# EAGLE design main board (EAGLE 6.5.0)
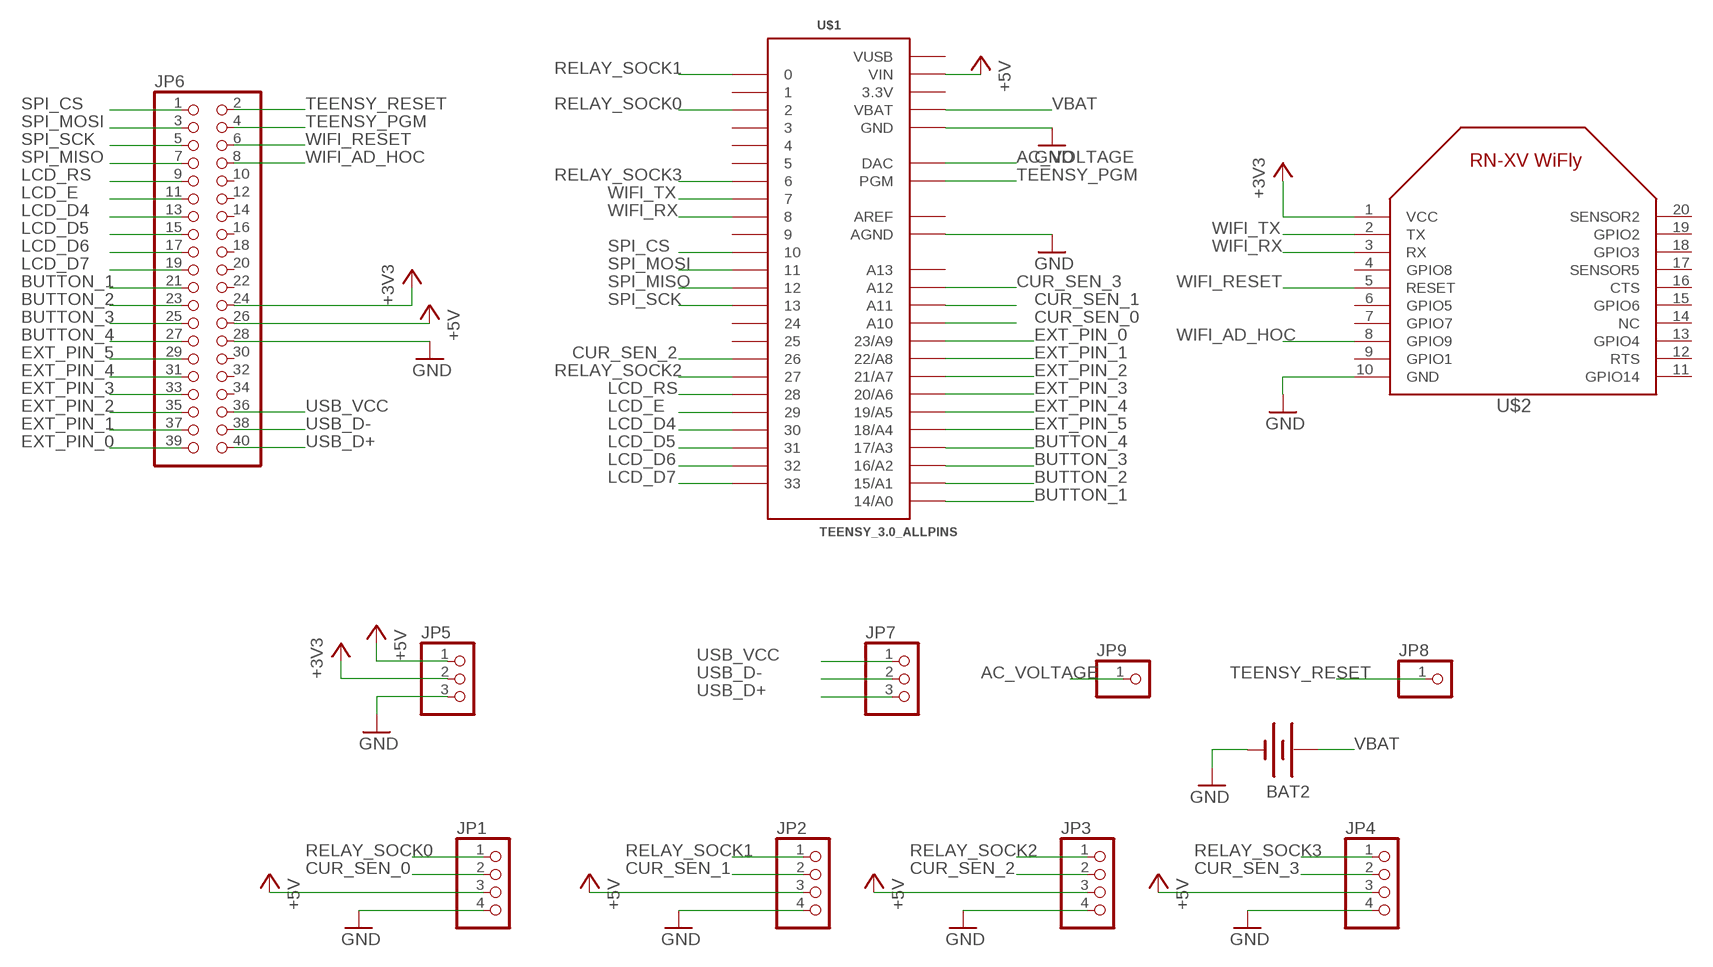
[diagram p0: schematic, sheet 1]

## Parts
BAT2  BATTERY20PTH  [BATTCOM_20MM_PTH]
JP1  PINHD-1X4/90  [1X04/90]
JP2  PINHD-1X4/90  [1X04/90]
JP3  PINHD-1X4/90  [1X04/90]
JP4  PINHD-1X4/90  [1X04/90]
JP5  PINHD-1X3/90  [1X03/90]
JP6  PINHD-2X20  [2X20]
JP7  PINHD-1X3  [1X03]
JP8  PINHD-1X1  [1X01]
JP9  PINHD-1X1  [1X01]
U$1  TEENSY_3.0_ALLPINS  [TEENSY_3.0_ALLPINS]
U$2  XBEEWIFLY  [XBEE]

## Nets
+3V3: JP5.2 JP6.24 U$2.1(VCC)
+5V: JP1.3 JP2.3 JP3.3 JP4.3 JP5.1 JP6.26 U$1.VIN
AC_VOLTAGE: JP9.1 U$1.RESET(DAC)
BUTTON_1: JP6.21 U$1.14/A0
BUTTON_2: JP6.23 U$1.15/A1
BUTTON_3: JP6.25 U$1.16/A2
BUTTON_4: JP6.27 U$1.17/A3
CUR_SEN_0: JP1.2 U$1.A10
CUR_SEN_1: JP2.2 U$1.A11
CUR_SEN_2: JP3.2 U$1.26
CUR_SEN_3: JP4.2 U$1.A12
EXT_PIN_0: JP6.39 U$1.23/A9
EXT_PIN_1: JP6.37 U$1.22/A8
EXT_PIN_2: JP6.35 U$1.21/A7
EXT_PIN_3: JP6.33 U$1.20/A6
EXT_PIN_4: JP6.31 U$1.19/A5
EXT_PIN_5: JP6.29 U$1.18/A4
GND: BAT2.2(-) JP1.4 JP2.4 JP3.4 JP4.4 JP5.3 JP6.28 U$1.AGND U$1.GND U$1.GND1(GND) U$1.GND2(GND) U$2.10(GND)
LCD_D4: JP6.13 U$1.30
LCD_D5: JP6.15 U$1.31
LCD_D6: JP6.17 U$1.32
LCD_D7: JP6.19 U$1.33
LCD_E: JP6.11 U$1.29
LCD_RS: JP6.9 U$1.28
RELAY_SOCK0: JP1.1 U$1.2
RELAY_SOCK1: JP2.1 U$1.0
RELAY_SOCK2: JP3.1 U$1.27
RELAY_SOCK3: JP4.1 U$1.6
SPI_CS: JP6.1 U$1.10
SPI_MISO: JP6.7 U$1.12
SPI_MOSI: JP6.3 U$1.11
SPI_SCK: JP6.5 U$1.13
TEENSY_PGM: JP6.4 U$1.PGM
TEENSY_RESET: JP6.2 JP8.1
USB_D+: JP6.40 JP7.3
USB_D-: JP6.38 JP7.2
USB_VCC: JP6.36 JP7.1
VBAT: BAT2.1(+) U$1.VBAT
WIFI_AD_HOC: JP6.8 U$2.8(GPIO9)
WIFI_RESET: JP6.6 U$2.5(RESET)
WIFI_RX: U$1.8 U$2.3(RX)
WIFI_TX: U$1.7 U$2.2(TX)
Unconnected: JP6.10 JP6.12 JP6.14 JP6.16 JP6.18 JP6.20 JP6.22 JP6.30 JP6.32 JP6.34 U$1.1 U$1.3 U$1.4 U$1.5 U$1.9 U$1.24 U$1.25 U$1.A13 U$2.4(GPIO8) U$2.6(GPIO5) U$2.7(GPIO7) U$2.9(GPIO1) U$2.11(GPIO14) U$2.12(RTS) U$2.13(GPIO4) U$2.14(NC) U$2.15(GPIO6) U$2.16(CTS) U$2.17(SENSOR5) U$2.18(GPIO3) U$2.19(GPIO2) U$2.20(SENSOR2)

## Power pins joined to a net without a drawn wire
3.3V: U$1.3.3V U$1.3.3V1(3.3V) U$1.3.3V2(3.3V)
AREF: U$1.AREF
VUSB: U$1.VUSB

## Library data of the parts
BAT2 = SparkFun-Electromechanical:BATTERY: Battery Holders Various common sizes : AA, AAA, 20mm coin cell and 12mm coin cell. 20MM_4LEGS, BATT-10373
JP1-JP4 = pinhead:PINHD-1X4: PIN HEADER
JP5 JP7 = pinhead:PINHD-1X3: PIN HEADER
JP6 = pinhead:PINHD-2X20: PIN HEADER
JP8 JP9 = pinhead:PINHD-1X1: PIN HEADER
U$1 = Teensy3.0:TEENSY_3.0_ALLPINS: Teensy 3.0 with all pin holes and optional SMD-mount unshrouded header on bottom of Teensy 3.0. For more basic versions, see 'Basic', '+4' and 'AllAnalogPins'. Requires the installation of a un-shrouded SMD header on the underside of the Teensy 3.0
U$2 = wifly:XBEE: RN-XV WiFly Module

## Board
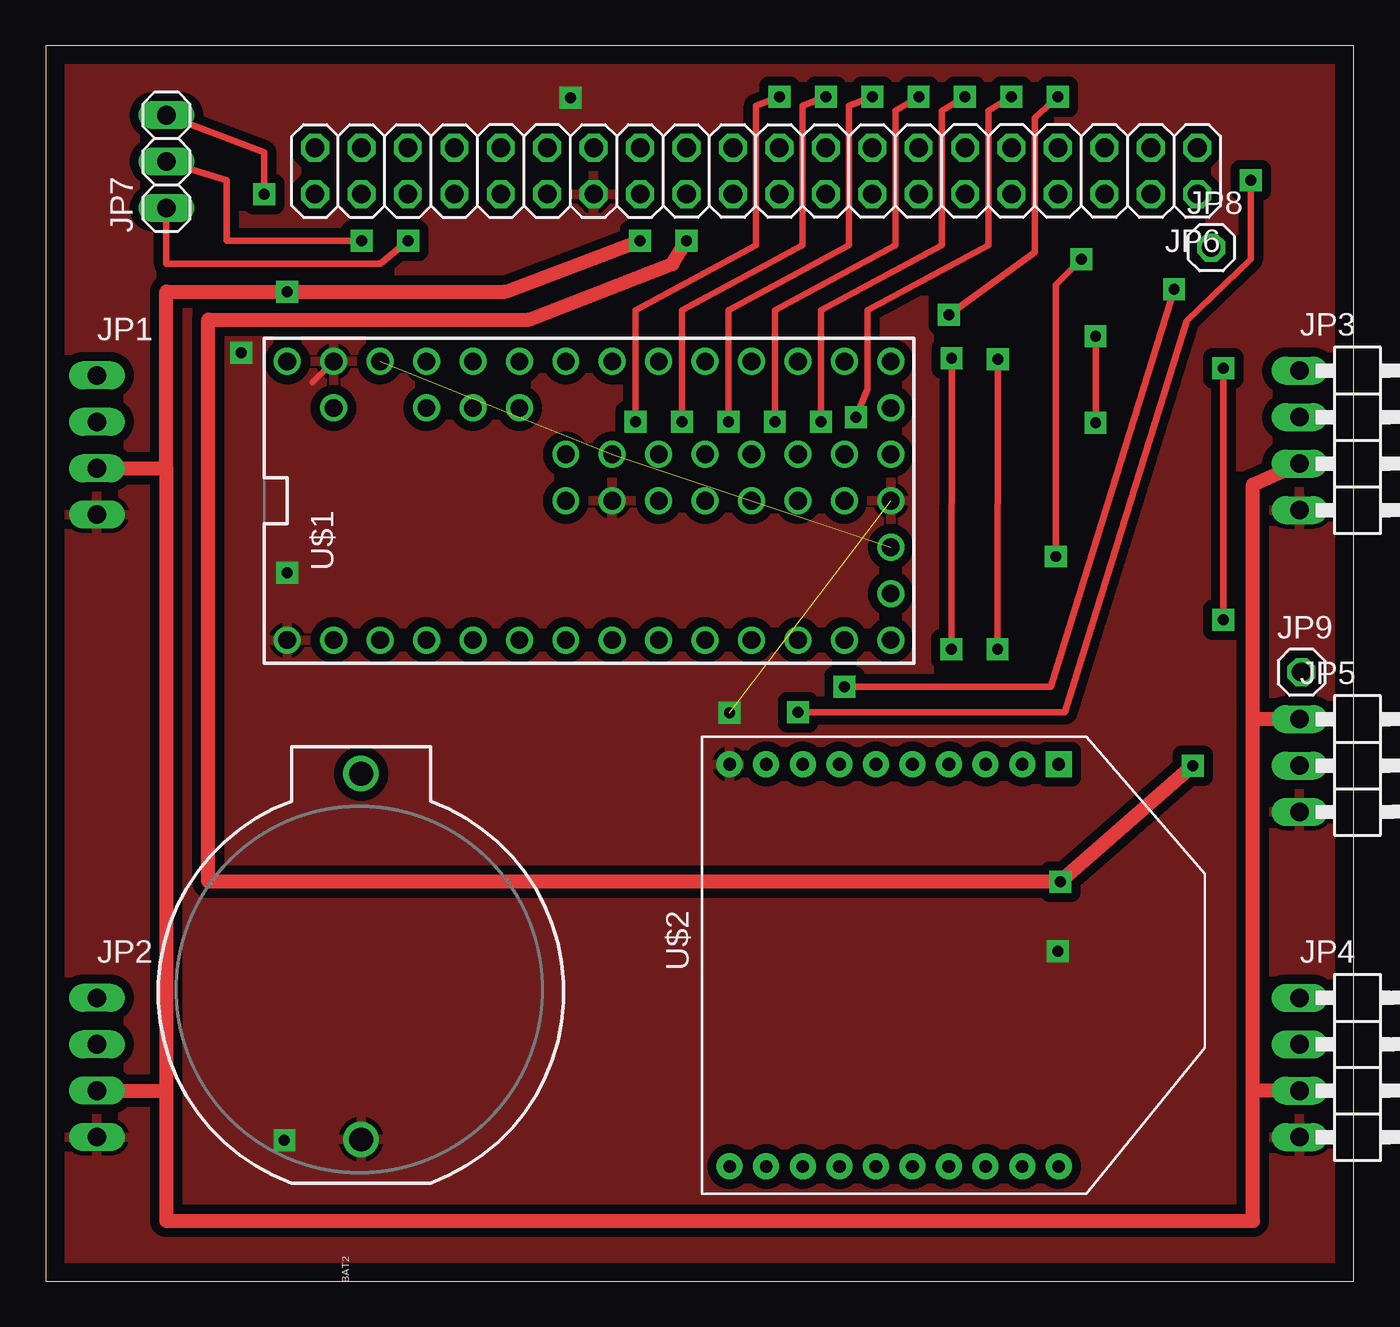
[diagram p1: board, top side]
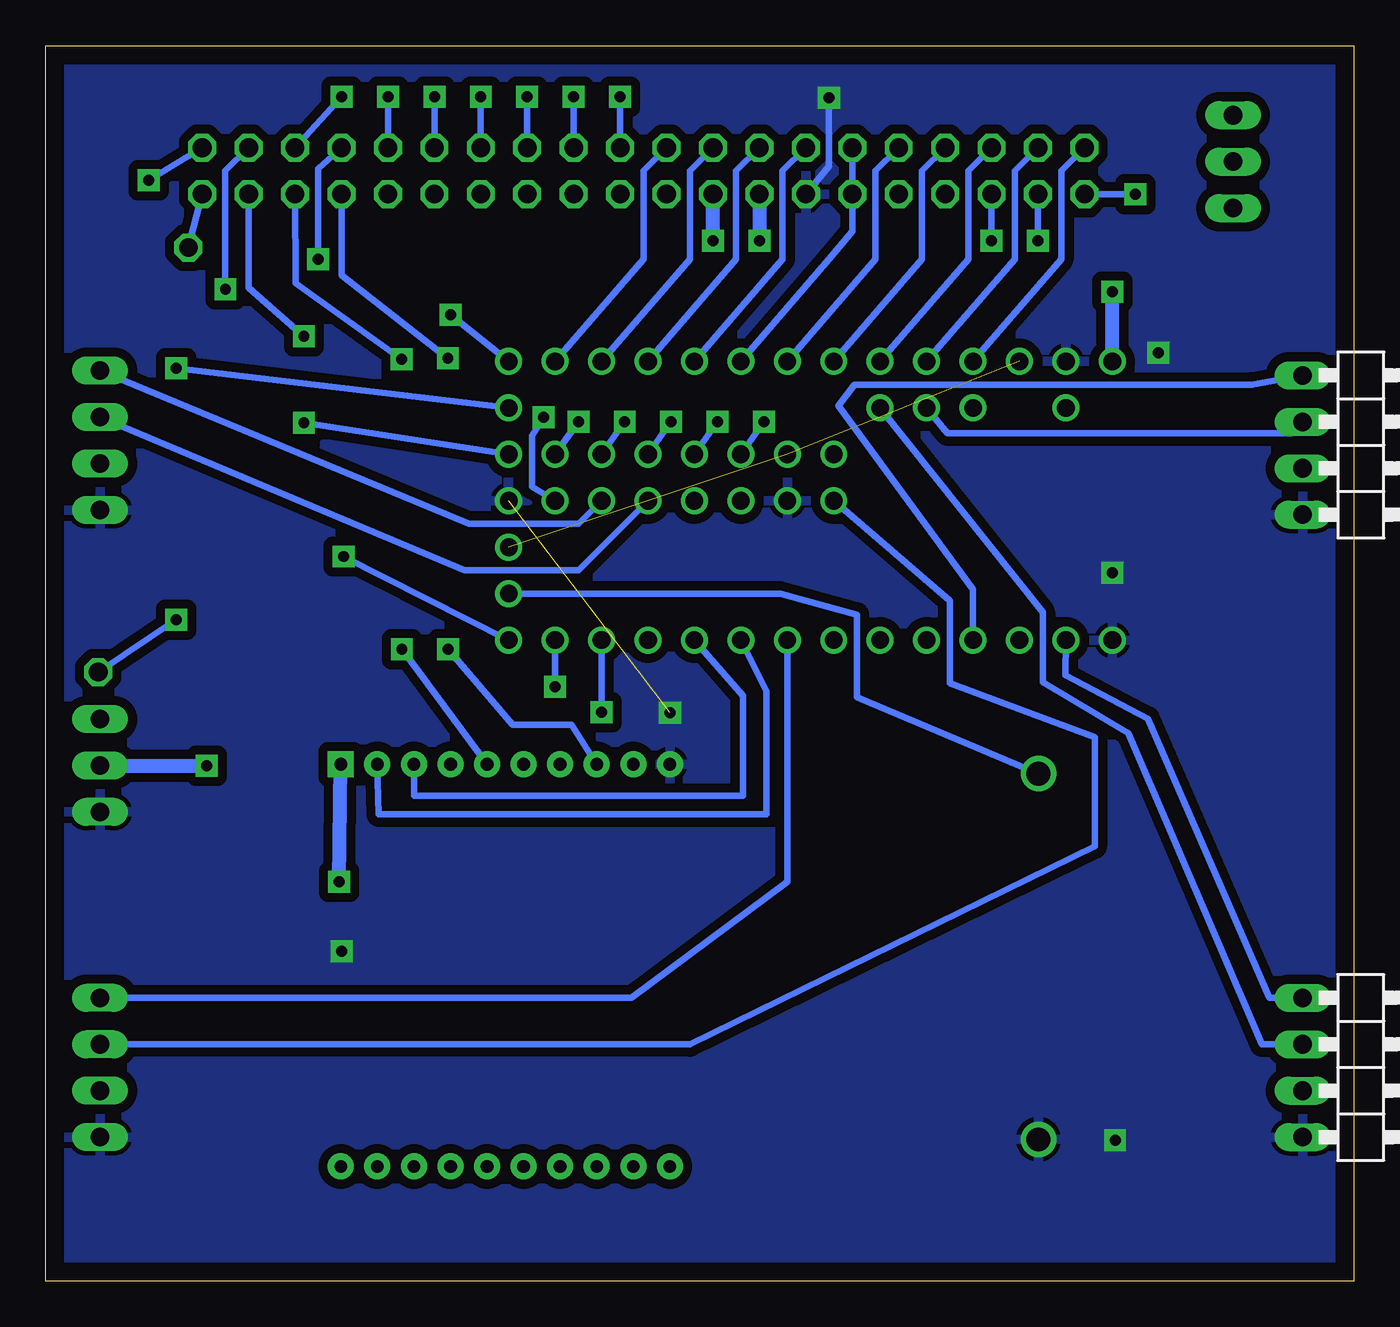
[diagram p2: board, bottom side, seen from below]

Size 71.55 x 67.55 mm. Coordinates in mm from the lower left corner, seen from the top.
Outline: 0,0 71.55,0 71.55,67.55 0,67.55 0,0
Copper layers (1*16): Top 0.035mm / dielectric 1.5mm / Bottom 0.035mm
Design rules "MWSEagleDesignRules2": minimum track width 13mil, minimum drill 22mil, track to track 13mil, track to pad 13mil, pad to pad 13mil, via to via 13mil, smd to smd 8mil, copper to edge 40mil, drill to drill 8mil, minimum pad ring 10mil, minimum via ring 8mil, stop-mask expansion 4mil, vias tented up to drill 0mil, thermal gap 10mil

### Footprints (pad centres in the part's own frame; a part is rotated, then mirrored left to right if it is on the bottom)
BATTCOM_20MM_PTH = drill 1.3: 1 11.85,0; 2 -8.15,0
1X04/90 = drill 1.016 long: 1 -3.81,-3.81; 2 -1.27,-3.81; 3 1.27,-3.81; 4 3.81,-3.81
1X03/90 = drill 1.016 long: 1 -2.54,-3.81; 2 0,-3.81; 3 2.54,-3.81
2X20 = drill 1.016 octagon: 1 -24.13,-1.27; 2 -24.13,1.27; 3 -21.59,-1.27; 4 -21.59,1.27; 5 -19.05,-1.27; 6 -19.05,1.27; 7 -16.51,-1.27; 8 -16.51,1.27; 9 -13.97,-1.27; 10 -13.97,1.27; 11 -11.43,-1.27; 12 -11.43,1.27; 13 -8.89,-1.27; 14 -8.89,1.27; 15 -6.35,-1.27; 16 -6.35,1.27; 17 -3.81,-1.27; 18 -3.81,1.27; 19 -1.27,-1.27; 20 -1.27,1.27; 21 1.27,-1.27; 22 1.27,1.27; 23 3.81,-1.27; 24 3.81,1.27; 25 6.35,-1.27; 26 6.35,1.27; 27 8.89,-1.27; 28 8.89,1.27; 29 11.43,-1.27; 30 11.43,1.27; 31 13.97,-1.27; 32 13.97,1.27; 33 16.51,-1.27; 34 16.51,1.27; 35 19.05,-1.27; 36 19.05,1.27; 37 21.59,-1.27; 38 21.59,1.27; 39 24.13,-1.27; 40 24.13,1.27
1X03 = drill 1.016 long: 1 -2.54,0; 2 0,0; 3 2.54,0
1X01 = drill 1.016 octagon: 1 0,0
TEENSY_3.0_ALLPINS = drill 0.965: 0 -7.62,13.97; 1 -7.62,11.43; 2 -7.62,8.89; 3 -7.62,6.35; 3.3V 7.62,11.43; 3.3V1 -2.54,-16.51; 3.3V2 2.54,-1.27; 4 -7.62,3.81; 5 -7.62,1.27; 6 -7.62,-1.27; 7 -7.62,-3.81; 8 -7.62,-6.35; 9 -7.62,-8.89; 10 -7.62,-11.43; 11 -7.62,-13.97; 12 -7.62,-16.51; 13 7.62,-16.51; 14/A0 7.62,-13.97; 15/A1 7.62,-11.43; 16/A2 7.62,-8.89; 17/A3 7.62,-6.35; 18/A4 7.62,-3.81; 19/A5 7.62,-1.27; 20/A6 7.62,1.27; 21/A7 7.62,3.81; 22/A8 7.62,6.35; 23/A9 7.62,8.89; 24 0,-3.81; 25 0,-6.35; 26 0,-8.89; 27 0,-11.43; 28 0,-13.97; 29 2.54,-13.97; 30 2.54,-11.43; 31 2.54,-8.89; 32 2.54,-6.35; 33 2.54,-3.81; A10 5.08,6.35; A11 5.08,3.81; A12 0,1.27; A13 2.54,1.27; AGND 7.62,13.97; AREF 5.08,8.89; GND -7.62,16.51; GND1 0,-16.51; GND2 0,-1.27; PGM 2.54,-16.51; RESET 5.08,-16.51; VBAT -5.08,-16.51; VIN 7.62,16.51; VUSB 5.08,13.97
XBEE = drill 0.7 pad 1.422 square: 1 -11,5.5 | drill 0.7 pad 1.422: 2 -11,3.5; 3 -11,1.5; 4 -11,-0.5; 5 -11,-2.5; 6 -11,-4.5; 7 -11,-6.5; 8 -11,-8.5; 9 -11,-10.5; 10 -11,-12.5; 11 11,-12.5; 12 11,-10.5; 13 11,-8.5; 14 11,-6.5; 15 11,-4.5; 16 11,-2.5; 17 11,-0.5; 18 11,1.5; 19 11,3.5; 20 11,5.5

### Placement (x,y rotation side)
BAT2  17.25,15.9 90 top
JP1  -1.02,45.72 270 bottom
JP2  -1.02,11.68 270 bottom
JP3  72.39,45.97 270 top
JP4  72.39,11.68 270 top
JP5  72.39,28.19 270 top
JP6  38.86,60.71 180 top
JP7  6.6,61.21 90 top
JP8  63.75,56.52 0 top
JP9  68.68,33.3 0 top
U$1  29.72,42.67 90 top
U$2  49.91,17.27 270 top

### Tracks (layer width: path | path; a pad name or v marks a point on that pad's centre or on a via)
3.3V  (2 unrouted)
+3V3  (via drill 0.6)
  Top 0.762: v62.74,28.19 v55.5,21.84 8.89,21.84 8.89,52.58 26.42,52.58 34.29,55.63 v35.05,56.9
  Bottom 0.762: JP5.2 v62.74,28.19 | v35.05,56.9 JP6.24 | v55.5,21.84 U$2.1
+5V  (via drill 0.6)
  Top 0.762: JP5.1 66.04,30.73 | 66.04,30.73 66.04,43.56 JP3.3 | JP4.3 66.04,10.41 | 66.04,10.41 66.04,30.73 | JP2.3 6.6,10.41 | 6.6,10.41 6.6,3.3 66.04,3.3 66.04,10.41 | JP1.3 6.6,44.45 | 6.6,44.45 6.6,10.41 | 6.6,44.45 6.6,54.1 v13.21,54.1 25.15,54.1 v32.51,56.9
  Bottom 0.762: JP6.26 v32.51,56.9 | U$1.VIN v13.21,54.1
AC_VOLTAGE  (via drill 0.6)
  Top 0.356: v64.41,49.91 v64.41,36.17
  Bottom 0.356: U$1.RESET v64.41,49.91 | v64.41,36.17 JP9.1
BUTTON_1
  Bottom 0.356: JP6.21 38.86,60.71 38.86,55.88 U$1.14/A0
BUTTON_2
  Bottom 0.356: JP6.23 36.32,60.71 36.32,55.88 U$1.15/A1
BUTTON_3
  Bottom 0.356: JP6.25 33.78,60.71 33.78,55.88 U$1.16/A2
BUTTON_4
  Bottom 0.356: JP6.27 31.24,60.71 31.24,55.88 U$1.17/A3
CUR_SEN_0
  Bottom 0.356: U$1.A10 22.23,46.35 3.43,46.35 JP1.2
CUR_SEN_1
  Bottom 0.356: U$1.A11 17.02,36.58 17.02,32.74 12.34,29.95 5.03,12.95 JP2.2
CUR_SEN_2
  Bottom 0.356: U$1.26 42.42,38.86 48.64,38.86 JP3.2
CUR_SEN_3
  Bottom 0.356: JP4.2 36.32,12.95 14.17,23.77 14.17,29.74 22.1,32.69 22.1,37.21 U$1.A12
EXT_PIN_0
  Bottom 0.356: U$1.23/A9 16,55.88 16,60.71 JP6.39
EXT_PIN_1
  Bottom 0.356: U$1.22/A8 18.54,55.88 18.54,60.71 JP6.37
EXT_PIN_2
  Bottom 0.356: JP6.35 21.08,60.71 21.08,55.88 U$1.21/A7
EXT_PIN_3
  Bottom 0.356: JP6.33 23.62,60.71 23.62,55.88 U$1.20/A6
EXT_PIN_4
  Bottom 0.356: JP6.31 26.16,60.71 26.16,55.88 U$1.19/A5
EXT_PIN_5
  Bottom 0.356: U$1.18/A4 28.7,55.88 27.43,57.4 JP6.29
GND  (via drill 0.6)  (1 unrouted)
  Top 0.356: U$1.AGND 14.61,49.15
  Bottom 0.356: JP6.28 28.7,60.96 v28.7,64.72
  other vias: 55.37,18.03 13.06,7.7 13.21,38.73 10.69,50.77 37.41,31.09
  pour Bottom (isolate 0.508): 0,67.56 -0.25,0 71.37,0 71.63,67.56
  pour Top (isolate 0.508): 0,67.56 0.25,0 71.63,0 71.37,67.56
LCD_D4  (via drill 0.6)
  Top 0.356: v39.88,46.99 39.88,53.09 46.48,56.64 46.48,64.01 v47.75,64.77
  Bottom 0.356: U$1.30 v39.88,46.99 | v47.75,64.77 JP6.13
LCD_D5  (via drill 0.6)
  Top 0.356: v37.34,46.99 37.34,53.09 43.94,56.64 43.94,64.26 v45.21,64.77
  Bottom 0.356: U$1.31 v37.34,46.99 | v45.21,64.77 JP6.15
LCD_D6  (via drill 0.6)
  Top 0.356: v34.8,46.99 34.8,53.09 41.4,56.64 41.4,64.26 v42.67,64.77
  Bottom 0.356: U$1.32 v34.8,46.99 | v42.67,64.77 JP6.17
LCD_D7  (via drill 0.6)
  Top 0.356: v32.26,46.99 32.26,53.09 38.86,56.64 38.86,64.26 v40.13,64.77
  Bottom 0.356: U$1.33 v32.26,46.99 | v40.13,64.77 JP6.19
LCD_E  (via drill 0.6)
  Top 0.356: v42.42,46.99 42.42,53.09 49.02,56.64 49.02,64.01 v50.29,64.77
  Bottom 0.356: U$1.29 v42.42,46.99 | v50.29,64.77 JP6.11
LCD_RS  (via drill 0.6)
  Top 0.356: v52.83,64.77 51.56,64.01 51.56,56.64 44.96,53.09 44.96,48.77 v44.32,47.24
  Bottom 0.356: U$1.28 44.96,43.43 44.96,46.23 v44.32,47.24 | v52.83,64.77 JP6.9
RELAY_SOCK0
  Bottom 0.356: JP1.1 5.59,49.02 27.3,49.02 28.19,47.88 20.83,37.85 U$1.2
RELAY_SOCK1
  Bottom 0.356: U$1.0 15.77,33.12 11.28,30.76 4.62,15.49 JP2.1
RELAY_SOCK2
  Bottom 0.356: U$1.27 42.42,41.4 48.39,41.4 JP3.1
RELAY_SOCK3
  Bottom 0.356: U$1.6 30.99,21.84 39.5,15.49 JP4.1
SPI_CS  (via drill 0.6)
  Top 0.356: v65.91,60.2 65.91,55.88 62.41,52.53 55.75,31.11 v41.15,31.11
  Bottom 0.356: JP6.1 v65.91,60.2 | v41.15,31.11 U$1.10
SPI_MISO  (via drill 0.6)
  Top 0.356: v56.64,55.88 55.24,54.48 v55.24,39.62
  Bottom 0.356: JP6.7 56.64,60.83 v56.64,55.88 | v55.24,39.62 U$1.12
SPI_MOSI  (via drill 0.6)
  Top 0.356: v61.72,54.23 54.99,32.51 v43.69,32.51
  Bottom 0.356: JP6.3 61.72,60.71 v61.72,54.23 | v43.69,32.51 U$1.11
SPI_SCK  (via drill 0.6)
  Top 0.356: v55.37,64.77 54.1,63.63 54.1,56.26 v49.4,52.83
  Bottom 0.356: JP6.5 v55.37,64.77 | v49.4,52.83 U$1.13
TEENSY_PGM  (via drill 0.6)
  Top 0.356: v57.43,51.66 v57.43,46.94
  Bottom 0.356: v57.43,46.94 U$1.PGM | JP6.4 60.45,54.33 v57.43,51.66
TEENSY_RESET
  Bottom 0.356: JP6.2 JP8.1
USB_D+  (via drill 0.6)
  Top 0.356: v11.94,59.44 11.94,61.72 JP7.3
  Bottom 0.356: JP6.40 v11.94,59.44
USB_D-  (via drill 0.6)
  Top 0.356: JP7.2 9.91,60.2 9.91,56.9 v17.27,56.9
  Bottom 0.356: JP6.38 v17.27,56.9
USB_VCC  (via drill 0.6)
  Top 0.356: v19.81,56.9 18.29,55.63 6.6,55.63 JP7.1
  Bottom 0.356: JP6.36 v19.81,56.9
VBAT
  Bottom 0.356: BAT2.1 27.18,31.92 27.18,36.45 31.37,37.59 U$1.VBAT
WIFI_AD_HOC  (via drill 0.6)
  Top 0.356: v49.55,50.47 v49.53,34.54
  Bottom 0.356: v49.55,50.47 55.37,54.99 JP6.8 | v49.53,34.54 46.02,30.43 42.78,30.43 U$2.8
WIFI_RESET  (via drill 0.6)
  Top 0.356: v52.09,50.42 v52.07,34.54
  Bottom 0.356: JP6.6 57.89,54.56 v52.09,50.42 | v52.07,34.54 U$2.5
WIFI_RX
  Bottom 0.356: U$1.8 33.4,32 33.4,26.54 51.41,26.54 U$2.3
WIFI_TX
  Bottom 0.356: U$2.2 53.33,25.53 32.13,25.53 32.13,32.26 U$1.7